# EAGLE schematic canSlaveV04 Flach (EAGLE 6.5.0)
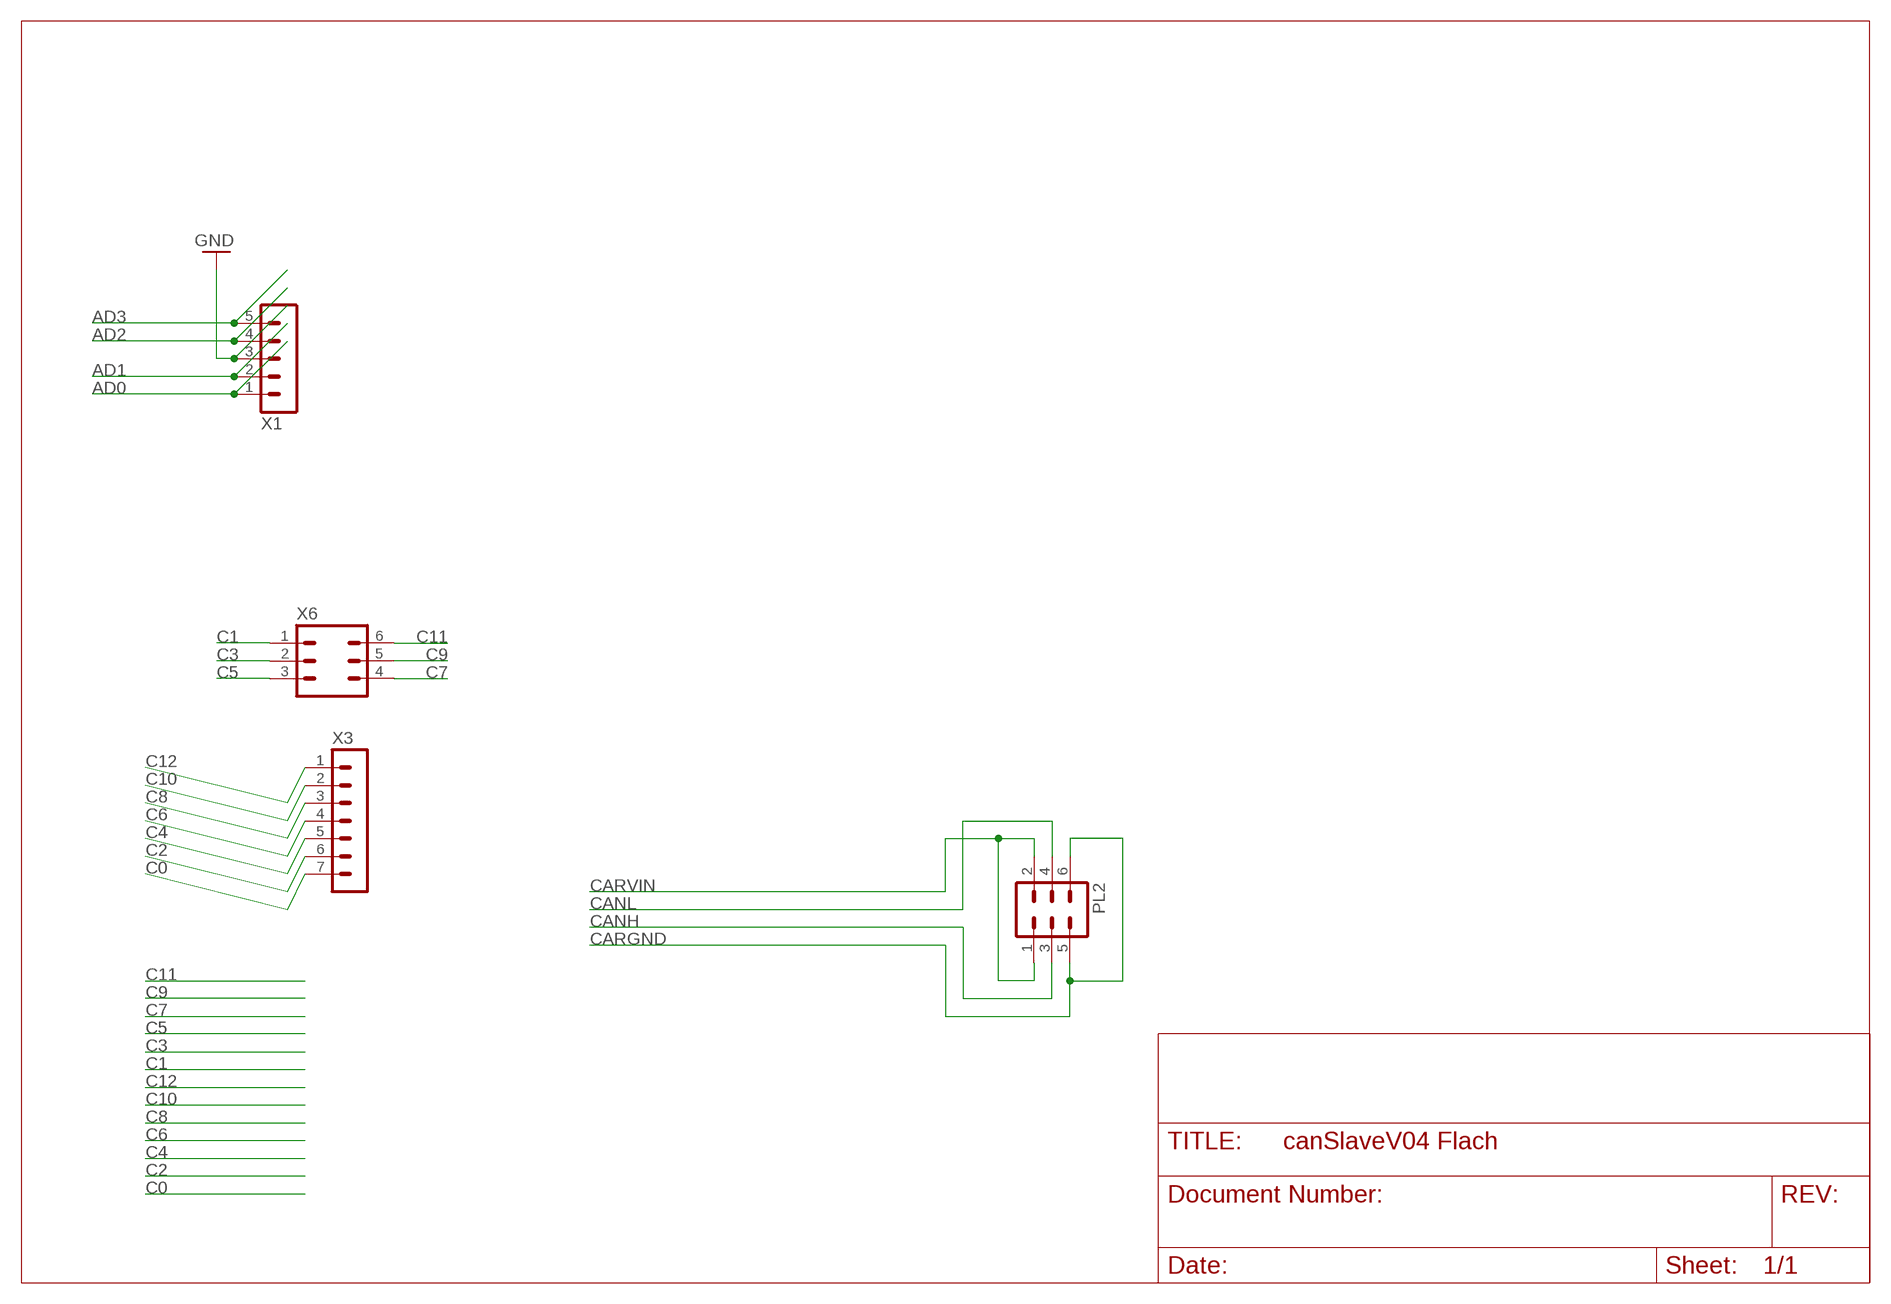
[diagram p0: schematic, sheet 1]

## Parts
PL2  06H  [06H]
X1  HEADER_POS5_43650-0500  [43650-0500]
X3  HEADER_POS7_43650-0700  [43650-0700]
X6  HEADER_POS6_43650-0600  [43650-0600]

## Nets
AD0: X1.1
AD1: X1.2
AD2: X1.4
AD3: X1.5
C0: X3.7
C1: X6.1
C2: X3.6
C3: X6.2
C4: X3.5
C5: X6.3
C6: X3.4
C7: X6.4
C8: X3.3
C9: X6.5
C10: X3.2
C11: X6.6
C12: X3.1
CANH: PL2.3
CANL: PL2.4
CARGND: PL2.5 PL2.6
CARVIN: PL2.1 PL2.2
GND: X1.3

## Library data of the parts
PL2 = con-harting-h:06H: CONNECTOR; OC_FARNELL: unknown; OC_NEWARK: unknown
X1 = con-molex-micro-fit-3_0:HEADER_POS5_?: Molex - Micro-Fit 3.0 Series connector, 3.00mm (0.118") pitch header, 5 positions.
X3 = con-molex-micro-fit-3_0:HEADER_POS7_?: Molex - Micro-Fit 3.0 Series connector, 3.00mm (0.118") pitch header, 7 positions.
X6 = con-molex-micro-fit-3_0:HEADER_POS6_?: Molex - Micro-Fit 3.0 Series connector, 3.00mm (0.118") pitch header, 6 positions.